# EAGLE design Woolllf Open Weeve_CE (EAGLE 9.6.2)
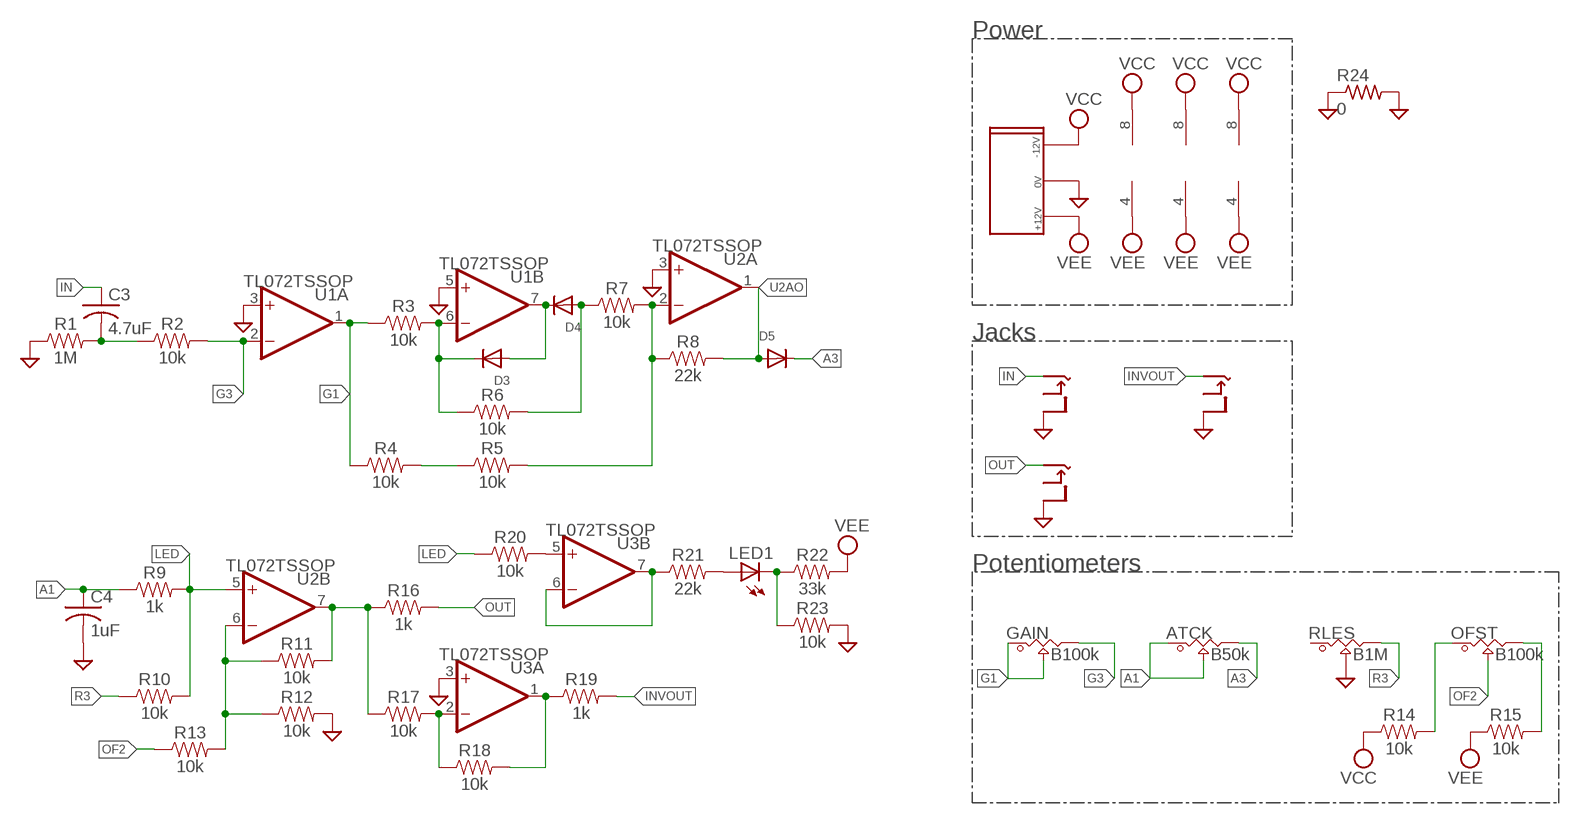
[diagram p0: schematic, sheet 1]

## Parts
ATCK  B50k  POT_9MM_SMD  [POT_9MM_SMD]
C3  4.7uF  C-USC0603  [C0603]
C4  1uF  C-USC0603  [C0603]
D3  DIODESOD-123  [SOD-123]
D4  DIODESOD-123  [SOD-123]
D5  DIODESOD-123  [SOD-123]
GAIN  B100k  POT_9MM_SMD  [POT_9MM_SMD]
LED1  LEDCHIP-LED0603  [CHIP-LED0603]
OFST  B100k  POT_9MM_SMD  [POT_9MM_SMD]
R1  1M  RESISTOR0603  [0603]
R2  10k  RESISTOR0603  [0603]
R3  10k  RESISTOR0603  [0603]
R4  10k  RESISTOR0603  [0603]
R5  10k  RESISTOR0603  [0603]
R6  10k  RESISTOR0603  [0603]
R7  10k  RESISTOR0603  [0603]
R8  22k  RESISTOR0603  [0603]
R9  1k  RESISTOR0603  [0603]
R10  10k  RESISTOR0603  [0603]
R11  10k  RESISTOR0603  [0603]
R12  10k  RESISTOR0603  [0603]
R13  10k  RESISTOR0603  [0603]
R14  10k  RESISTOR0603  [0603]
R15  10k  RESISTOR0603  [0603]
R16  1k  RESISTOR0603  [0603]
R17  10k  RESISTOR0603  [0603]
R18  10k  RESISTOR0603  [0603]
R19  1k  RESISTOR0603  [0603]
R20  10k  RESISTOR0603  [0603]
R21  22k  RESISTOR0603  [0603]
R22  33k  RESISTOR0603  [0603]
R23  10k  RESISTOR0603  [0603]
R24  0  R-US_R0402  [R0402]
RLES  B1M  POT_9MM_SMD  [POT_9MM_SMD]
U1  TL072TSSOP  [TSSOP-8]
U2  TL072TSSOP  [TSSOP-8]
U3  TL072TSSOP  [TSSOP-8]
U$1  EURO_POW_CEH  [EURO_POW_CEH]
U$2  THONKICONN_CE_3X_COMG_NOSW  [1.27MM_CE_3X_COMG_NOSW]

## Nets
A1: ATCK.1 ATCK.2 C4.1 R9.1
A3: ATCK.3 D5.C
G1: GAIN.1 GAIN.2 R3.1 R4.1 U1.1(A:OUT)
G3: GAIN.3 R2.2 U1.2(A:-IN)
GND: C4.2 R1.1 R12.2 R23.2 R24.1 R24.2 RLES.2 U1.3(A:+IN) U1.5(B:+IN) U2.3(A:+IN) U3.3(A:+IN) U$1.GND U$2.0(S)
IN: C3.1 U$2.1(T)
INVOUT: R19.2 U$2.2(T)
LED: R9.2 R10.2 R20.1 U2.5(B:+IN)
N$1: LED1.A R21.2
N$3: C3.2 R1.2 R2.1
N$4: D3.C R3.2 R6.1 U1.6(B:-IN)
N$5: D3.A D4.C U1.7(B:OUT)
N$6: D4.A R6.2 R7.1
N$7: R20.2 U3.5(B:+IN)
N$8: R4.2 R5.1
N$9: R5.2 R7.2 R8.1 U2.2(A:-IN)
N$10: R11.1 R12.1 R13.2 U2.6(B:-IN)
N$11: R11.2 R16.1 R17.1 U2.7(B:OUT)
N$12: OFST.1 R14.2
N$13: OFST.3 R15.2
N$14: R17.2 R18.1 U3.2(A:-IN)
N$15: R18.2 R19.1 U3.1(A:OUT)
N$16: R21.1 U3.6(B:-IN) U3.7(B:OUT)
N$18: LED1.C R22.1 R23.1
OF2: OFST.2 R13.1
OUT: R16.2 U$2.3(T)
R3: R10.1 RLES.3
U2AO: D5.A R8.2 U2.1(A:OUT)
VCC: R14.1 U1.8(P:V+) U2.8(P:V+) U3.8(P:V+) U$1.-12V
VEE: R15.1 R22.2 U1.4(P:V-) U2.4(P:V-) U3.4(P:V-) U$1.+12V
Unconnected: RLES.1

## Notes on the sheet
- Power
- Jacks
- Potentiometers

## Library data of the parts
ATCK GAIN OFST RLES = Mech_BO_CE_SW:POT_9MM_SMD
C3 C4 = adafruit:C-US: CAPACITOR, American symbol
D3-D5 = adafruit:DIODE: Diode SMADIODE - SMA Surface Mount Package 20V 1A Schottky Diode Digikey: 641-1014-6-ND DO-1N4148 - Through Hole Small Current Diode SOD-123 20V 1 A (.5mV Vf) Schottky Diode - Digikey: MBRX120TPMSCT-ND SOD-323 10V 570mA (.38mV Vf, 3ns) Schottky Diode - Digikey: ZLLS410CT-ND SOD-523 30V 30mA Schottky Diode (RB751S-40TE61) - Digikey: RB751S-40TE61CT-ND SOT23-R/W - SOT23 Package (R = Solder Paste/Reflow Ovens, W = Hand-Soldering) BAT54Film 40V 300mA - Digikey: 497-7162-1-ND
LED1 = adafruit:LED: LED OSRAM: - CHIPLED LG R971, LG N971, LY N971, LG Q971, LY Q971, LO R971, LY R971 LH N974, LH R974 LS Q976, LO Q976, LY Q976 LO Q996 - Hyper CHIPLED LW Q18S LB Q993, LB Q99A, LB R99A - SideLED LS A670, LO A670, LY A670, LG A670, LP A670 LB A673, LV A673, LT A673, LW A673 LH A674 LY A675 LS A676, LA A676, LO A676, LY A676, LW A676 LS A679, LY A679, LG A679 - Hyper Micro SIDELED® LS Y876, LA Y876, LO Y876, LY Y876 LT Y87S - SmartLED LW L88C, LW L88S LB L89C, LB L89S, LG L890 LS L89K, LO L89K, LY L89K LS L896, LA L896, LO L896, LY L896 - TOPLED LS T670, LO T670, LY T670, LG T670, LP T670 LSG T670, LSP T670, LSY T670, LOP T670, LYG T670 LG T671, LOG T671, LSG T671 LB T673, LV T673, LT T673, LW T673 LH T674 LS T676, LA T676, LO T676, LY T676, LB T676, LH T676, LSB T676, LW T676 LB T67C, LV T67C, LT T67C, LS T67K, LO T67K, LY T67K, LW E67C LS E67B, LA E67B, LO E67B, LY E67B, LB E67C, LV E67C, LT E67C LW T67C LS T679, LY T679, LG T679 LS T770, LO T770, LY T770, LG T770, LP T770 LB T773, LV T773, LT T773, LW T773 LH T774 LS E675, LA E675, LY E675, LS T675 LS T776, LA T776, LO T776, LY T776, LB T776 LHGB T686 LT T68C, LB T68C - Hyper Mini TOPLED® LB M676 - Mini TOPLED Santana® LG M470 LS M47K, LO M47K, LY M47K Source: http://www.osram.convergy.de/
R1-R23 = SparkFun-Resistors:RESISTOR: Generic Resistor Package
R24 = adafruit:R-US_: RESISTOR, American symbol
U1-U3 = MusicThingModular:TL072: Generic Dual Op Amp
U$1 = 2.54mm_PowHeader_SMD:EURO_POW_CEH: Eurorack Power Header Reduced Card Edge Surface Mount Pads
U$2 = THONKICONN_BE:THONKICONN_CE_3X_COMG_NOSW

## Board
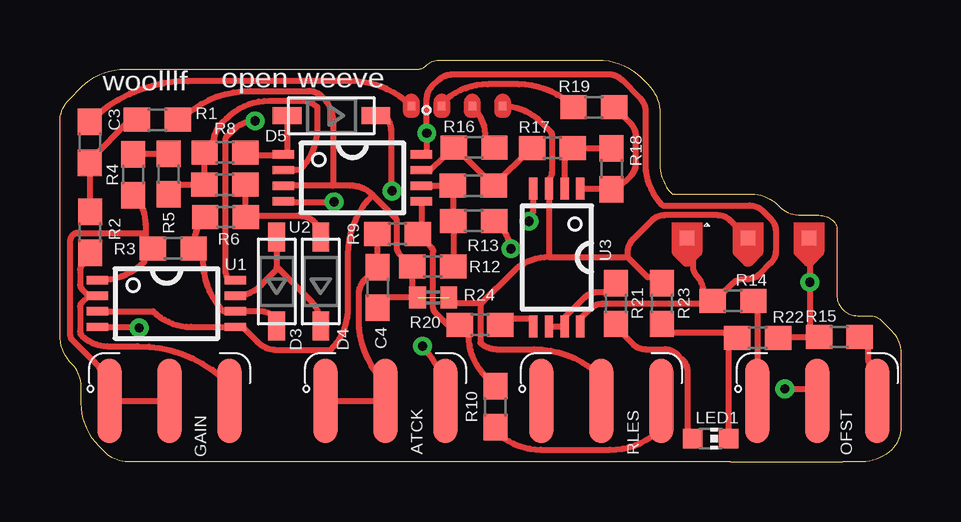
[diagram p1: board, top side]
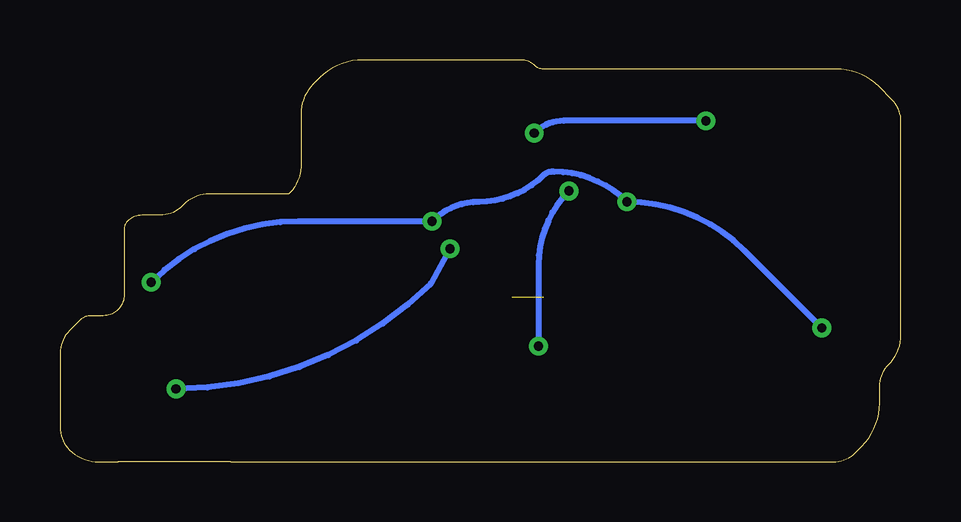
[diagram p2: board, bottom side, seen from below]

Size 35.05 x 16.76 mm. Coordinates in mm from the lower left corner, seen from the top.
Outline: 27.94,0 32.64,0 33.45,0 arc45 34.67,0.51 arc45 35.05,1.43 35.05,4.54 arc45 34.67,5.46 34.22,5.92 arc45 33.78,6.1 33.25,6.1 arc-45 32.64,6.35 arc-45 32.38,6.96 32.38,9.73 arc45 32.26,10.03 arc45 31.64,10.29 30.89,10.29 arc-45 29.97,10.67 29.91,10.73 arc45 28.83,11.18 25.53,11.18 25.47,11.23 arc-45 25.02,12.45 25.02,14.52 arc45 24.51,15.75 24.24,16.02 arc45 22.44,16.76 15.85,16.76 arc45 15.24,16.51 arc-45 14.93,16.38 2.7,16.38 arc45 0.91,15.64 0.38,15.11 arc45 0,14.19 0,5.29 arc45 0.51,4.06 arc-45 0.89,3.14 0.89,2.45 arc45 1.63,0.65 1.91,0.38 arc45 2.83,0 27.94,0
Copper layers (1*16): Top 0.035mm / dielectric 1.5mm / Bottom 0.035mm
Design rules "default *": minimum track width 6mil, minimum drill 0.35mm, track to track 6mil, track to pad 6mil, pad to pad 6mil, via to via 6mil, smd to smd 6mil, copper to edge 10mil, drill to drill 6mil, minimum pad ring 10mil, minimum via ring 8mil, stop-mask expansion 4mil, vias tented up to drill 0mil, thermal gap 10mil

### Footprints (pad centres in the part's own frame; a part is rotated, then mirrored left to right if it is on the bottom)
POT_9MM_SMD = smd 0.991 x 3.505: 1 -2.5,0; 2 0,0; 3 2.5,0
C0603 = smd 1.1 x 1: 1 -0.85,0; 2 0.85,0
SOD-123 = smd 1.2 x 0.7: A 1.85,0; C -1.85,0
CHIP-LED0603 = smd 0.8 x 0.8: A 0,-0.75; C 0,0.75
0603 = smd 1.1 x 1: 1 -0.85,0; 2 0.85,0
R0402 = smd 0.7 x 0.9: 1 -0.65,0; 2 0.65,0
TSSOP-8 = smd 0.9 x 0.35: 1 -2.875,0.975; 2 -2.875,0.325; 3 -2.875,-0.325; 4 -2.875,-0.975; 5 2.875,-0.975; 6 2.875,-0.325; 7 2.875,0.325; 8 2.875,0.975
EURO_POW_CEH = smd 0.6 x 0.6: +12V 0,-3.175; -12V 5.08,-3.175; GND 2.54,-3.175
1.27MM_CE_3X_COMG_NOSW = smd 0.318 x 0.318: 0 3.81,0; 1 0,0; 2 1.27,0; 3 2.54,0

### Placement (x,y rotation side)
ATCK  13.57,2.54 0 top
C3  1.24,13.33 270 top
C4  13.24,7.28 270 top
D3  9.04,7.53 90 top
D4  10.87,7.53 90 top
D5  11.31,14.44 180 top
GAIN  4.57,2.54 0 top
LED1  27.12,0.97 270 top
OFST  31.57,2.54 0 top
R1  4.06,14.28 180 top
R2  1.25,9.57 270 top
R3  4.72,8.9 0 top
R4  3.06,11.97 90 top
R5  4.52,12.01 270 top
R6  6.9,10.21 0 top
R7  6.87,11.56 180 top
R8  6.88,12.9 0 top
R9  14.07,9.51 0 top
R10  18.16,2.3 90 top
R11  17.23,11.52 0 top
R12  15.54,8.15 180 top
R13  17.25,10.05 180 top
R14  28.06,6.72 0 top
R15  32.49,5.21 0 top
R16  17.27,13.12 0 top
R17  20.53,13.09 0 top
R18  22.98,12.22 270 top
R19  22.26,14.8 180 top
R20  17.51,5.71 0 top
R21  23.17,6.61 270 top
R22  29.08,5.17 0 top
R23  25.1,6.61 90 top
R24  15.56,6.86 180 top
RLES  22.57,2.54 0 top
U1  4.45,6.6 0 top
U2  12.19,11.85 0 top
U3  20.71,8.53 270 top
U$1  31.22,6.15 180 top
U$2  14.65,14.84 0 top

### Tracks (layer width: path | path; a pad name or v marks a point on that pad's centre or on a via)
A1
  Top 0.254: R9.1 13.22,8.14 C4.1 12.72,7.6 arc45 12.46,6.99 12.46,5.93 arc45 13.57,3.25 ATCK.2 ATCK.1
A3  (via drill 0.38)
  Top 0.254: D5.C 13.54,14.44 arc-45 13.8,13.82 13.8,11.41 arc45 v13.84,11.3 | v15.11,4.83 15.11,4.77 15.17,4.71 arc-45 ATCK.3
  Bottom 0.254: v13.84,11.3 arc-45 15.11,8.24 v15.11,4.83
G1
  Top 0.254: GAIN.2 GAIN.1 2.07,2.79 1.97,2.89 arc45 1.45,4.15 0.51,5.1 arc-45 0.43,5.28 0.43,9.25 arc-45 0.51,9.43 0.56,9.48 arc-45 0.74,9.55 3.56,9.55 | U1.1 1.66,7.58 arc45 3.52,8.35 arc-45 3.57,8.47 3.87,8.78 R3.1 3.56,9.21 3.56,9.55 | R4.1 arc-45 3.56,9.9 3.56,9.55
G3
  Top 0.254: 1.2,6.93 0.92,7.21 arc-45 0.84,7.39 0.84,8.02 arc-45 0.92,8.2 1.25,8.53 R2.2 | U1.2 1.2,6.93 | 1.2,6.93 0.92,6.64 arc45 0.84,6.46 0.84,5.44 arc45 0.92,5.26 arc45 1.97,4.83 3.23,4.83 arc-45 7.07,3.23 GAIN.3
GND  (1 unrouted)
  Top 0.254: 13.04,11.13 13.98,10.2 arc-45 14.05,10.02 14.05,8.9 arc45 14.12,8.72 R12.2 14.69,7.08 R24.2 13.67,6.86 C4.2 | 13.04,11.13 arc45 12.1,11.52 11.38,11.52 | 11.38,11.52 U2.3 | R1.1 5.05,14.28 arc-45 7.94,15.47 10.35,15.47 arc-45 10.93,15.23 arc-45 11.38,14.14 11.38,11.52 | R23.2 arc45 24.49,7.71 23.66,8.54 | U$2.0 arc-45 20.04,14.18 20.47,13.75 arc-45 20.51,13.65 20.51,12.08 arc-45 20.39,11.78 U3.3 20.39,8.54 | U$1.GND 27.95,10.06 arc45 27.41,10.29 25.21,10.29 arc45 24.67,10.06 23.88,9.28 arc45 23.66,8.74 23.66,8.54 | R24.1 16.45,6.62 17.53,6.62 | 17.53,6.62 17.58,6.62 18.87,7.91 arc-45 20.39,8.54 | RLES.2 22.57,3.54 arc45 19.76,4.7 18.19,4.7 arc-45 17.53,4.97 17.53,6.62 | 20.39,8.54 23.66,8.54 | U1.3 3.89,6.28 arc45 5.46,5.63 U1.5 7.61,5.63 8.24,5 arc45 9.04,4.67 11.29,4.67 arc45 12.01,6.42 12.01,8.65 arc-45 13.04,11.13
IN
  Top 0.254: U$2.1 arc45 12.13,15.88 5.34,15.88 arc45 C3.1
INVOUT
  Top 0.254: U$2.2 15.92,14.95 arc-45 17.84,15.75 19.12,15.75 arc-45 R19.2
LED
  Top 0.254: U2.5 15.07,9.65 R9.2 15.49,8.94 arc-45 15.56,8.76 15.56,6.42 arc45 15.64,6.24 16.16,5.71 R20.1 17.04,5.33 17.04,5.29 17.04,5.29 arc45 17.76,3.55 R10.2
N$1
  Top 0.254: R21.2 23.17,5.63 23.88,4.92 arc45 24.42,4.7 25.2,4.7 arc-45 25.74,4.48 25.94,4.28 arc-45 26.16,3.74 26.16,1.19 LED1.A
N$3
  Top 0.254: 1.25,12.46 arc45 C3.2 | R1.2 2.94,14.28 1.25,12.59 1.25,12.46 | R2.1 1.25,12.46
N$4
  Top 0.254: R6.1 arc45 5.57,9.05 R3.2 5.96,8.52 5.96,8.37 arc45 6.82,6.28 U1.6 8.32,6.28 arc-45 9.04,5.98 D3.C
N$5
  Top 0.254: U1.7 arc45 8.38,7.37 9.04,8.02 9.04,8.15 | D3.A 9.04,8.15 | D4.C arc45 10.42,6.76 9.04,8.15
N$6
  Top 0.254: R7.1 7.72,10.23 R6.2 7.8,10.25 9.99,10.25 arc-90 D4.A
N$7
  Top 0.254: R20.2 18.49,5.97 19.61,5.97 U3.5
N$8
  Top 0.254: R4.2 3.09,12.86 R5.1
N$9
  Top 0.254: R5.2 4.93,11.56 R7.2 6.03,11.57 R8.1 6.41,13.29 arc-45 6.77,14.15 6.94,14.32 arc-45 8.73,15.06 10.07,15.06 arc-45 10.72,14.8 10.72,13.94 arc-45 9.99,12.17 U2.2
N$10
  Top 0.254: U2.6 R11.1 16.38,10.07 R13.2 16.4,8.16 R12.1
N$11
  Top 0.254: U2.7 15.44,12.17 16,12.73 16.03,12.73 R16.1 16.48,13.12 R11.2 19.66,13.09 R17.1
N$12
  Top 0.254: R14.2 29.08,6.72 OFST.1
N$13
  Top 0.254: R15.2 33.69,4.85 33.69,4.38 arc45 33.91,3.84 34.07,3.68 OFST.3
N$14
  Top 0.254: U3.2 21.04,12.75 R17.2 22.96,13.09 R18.1
N$15
  Top 0.254: U3.1 22.96,11.4 R18.2 23.24,11.37 23.8,11.93 arc45 24.02,12.47 24.02,13.57 arc45 23.8,14.11 R19.1
N$16
  Top 0.254: U3.6 U3.7 21.04,6.02 21.87,6.85 arc-45 22.41,7.07 22.79,7.07 R21.1
N$18
  Top 0.254: R23.1 25.48,5.37 28.03,5.37 R22.1 27.86,4.8 27.86,1.03 LED1.C
OF2  (via drill 0.38)
  Top 0.254: R13.1 18.36,9.79 arc-45 18.74,8.89 v18.8,8.89 | v30.23,3.05 31.32,3.05 31.57,2.79 OFST.2
  Bottom 0.254: v18.8,8.89 19.6,7.45 arc45 v30.23,3.05
OUT
  Top 0.254: U$2.3 arc-45 17.73,13.51 17.73,13.5 R16.2
R3
  Top 0.254: R10.1 18.16,1.29 arc45 20.04,0.51 22.93,0.51 arc45 25.07,1.4 RLES.3
U2AO
  Top 0.254: R8.2 7.86,12.78 9.27,12.78 U2.1 9.44,12.82 9.46,12.84 D5.A
VCC  (via drill 0.38)
  Top 0.254: U$1.-12V 26.4,9.07 26.4,8.13 arc45 26.56,7.75 arc-45 26.82,7.1 R14.1 | U3.8 21.69,5.97 22.08,6.36 arc-45 22.62,6.58 27.07,6.58 R14.1 | U2.8 15.29,12.82 v15.29,13.72 15.29,15.13 arc-47 15.53,15.69 15.81,15.95 arc-43 16.33,16.15 22.88,16.15 arc-45 23.42,15.93 24.2,15.15 arc-45 24.43,14.61 24.43,12.37 arc45 25.12,10.69 28.76,10.69 arc-45 29.3,10.47 29.62,10.15 arc-45 29.84,9.61 29.84,8.82 arc-45 29.62,8.29 29.18,7.84 arc-45 28.64,7.62 28.52,7.62 arc45 27.98,7.4 27.3,6.72 R14.1 | v8.13,14.22 arc45 7.24,13.85 6.97,13.59 arc45 6.89,13.41 6.89,8 arc45 7.07,7.58 U1.8
  Bottom 0.254: v8.13,14.22 14.06,14.22 arc-45 v15.29,13.72
VEE  (via drill 0.38)
  Top 0.254: R22.2 29.97,5.21 R15.1 31.26,5.59 v31.26,7.49 31.26,9.29 U$1.+12V | U2.4 9.34,10.85 v11.43,10.85 | v19.56,10.03 19.56,10.08 arc45 19.74,10.51 U3.4 | U1.4 3.26,5.63 v3.3,5.59
  Bottom 0.254: v3.3,5.59 6.53,8.82 arc-45 v11.43,10.85 arc-45 14.46,12.1 14.56,12.1 arc-45 14.9,11.96 arc45 17.59,10.85 arc-45 v19.56,10.03 25.12,10.03 arc-45 v31.26,7.49

### Text on the board
tPlace: open | weeve | woolllf